# Altium project sht30.PrjPcb
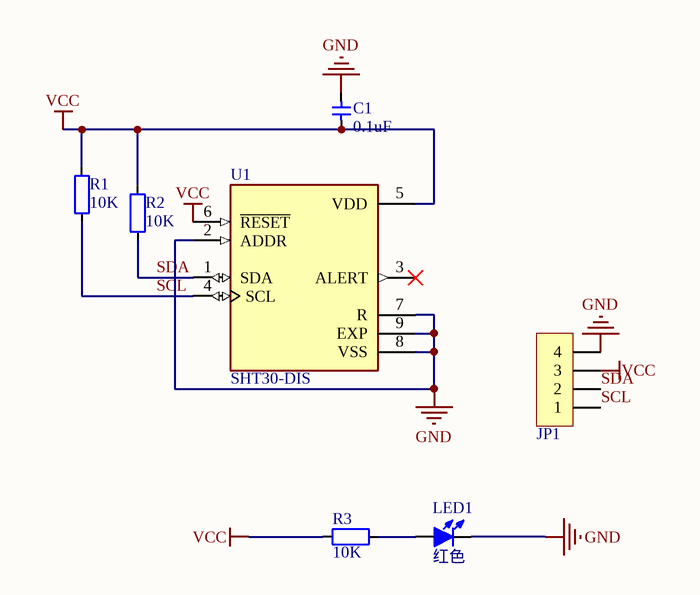
[diagram p0: Sheet2.SchDoc]
1 sheet, 7 parts. Net scope: global (net labels, ports and power ports of the same name join across sheets).
Board file: PCB1.PcbDoc

## Sheet Sheet2.SchDoc
size A4; SheetNumber: 1; SheetTotal: 1

### Parts
C1  0.1uF  [CAP_0402]
JP1  HDR-1X4  [HDR2.54-LI-4P]  (value not drawn)
LED1  红色  [LED0603_R]
R1  10K  [RES_0402]
R2  10K  [RES_0402]
R3  10K  [RES_0402]
U1  SHT30-DIS  [DFN250X250X100-9N]

### Nets
GND: C1.2 JP1.4 LED1.2(K) U1.2(ADDR) U1.7(R) U1.8(VSS) U1.9(EXP)
VCC: C1.1 JP1.3 R1.2 R2.2 R3.2 U1.5(VDD) U1.6(~{RESET})
SCL: JP1.1 R1.1 U1.4(SCL)
SDA: JP1.2 R2.1 U1.1(SDA)
NetLED1_1: LED1.1(A) R3.1

Not connected (* = marked no-connect by the designer): U1 3(ALERT)*

### Library data of the parts
C1 = 电容-0402: Capacitor; Value: 0.1u
JP1 = Header 4: 4P接插件; 封装库来自淘宝卖家 ID：黄晶宝石: 其他店铺购入均为盗版假冒封装库; 联系卖家，免费查找封装: 唯一出售店铺网址https://shop463601444.taobao.com; BOM名称: 4P接插件
LED1 = LED-SMD: 贴片LED; 联系卖家 免费查找封装: 封装库来自淘宝卖家ID：黄晶宝石; BOM名称: 贴片LED
R1-R3 = 电阻-0402: Resistor; Value: 22R
U1 = SHT30-DIS: SHT3x Series 5.5 V 卤3 %RH 0 to 100% Temperature and Humidity Sensor - DFN-8; MF: {'manufacturer': u'Sensirion AG'}; Package: None; Value: *; Availability: Unavailable; MP: SHT30-DIS; Price: None